# EAGLE schematic quadcopter_tawfic (EAGLE 8.1.1)
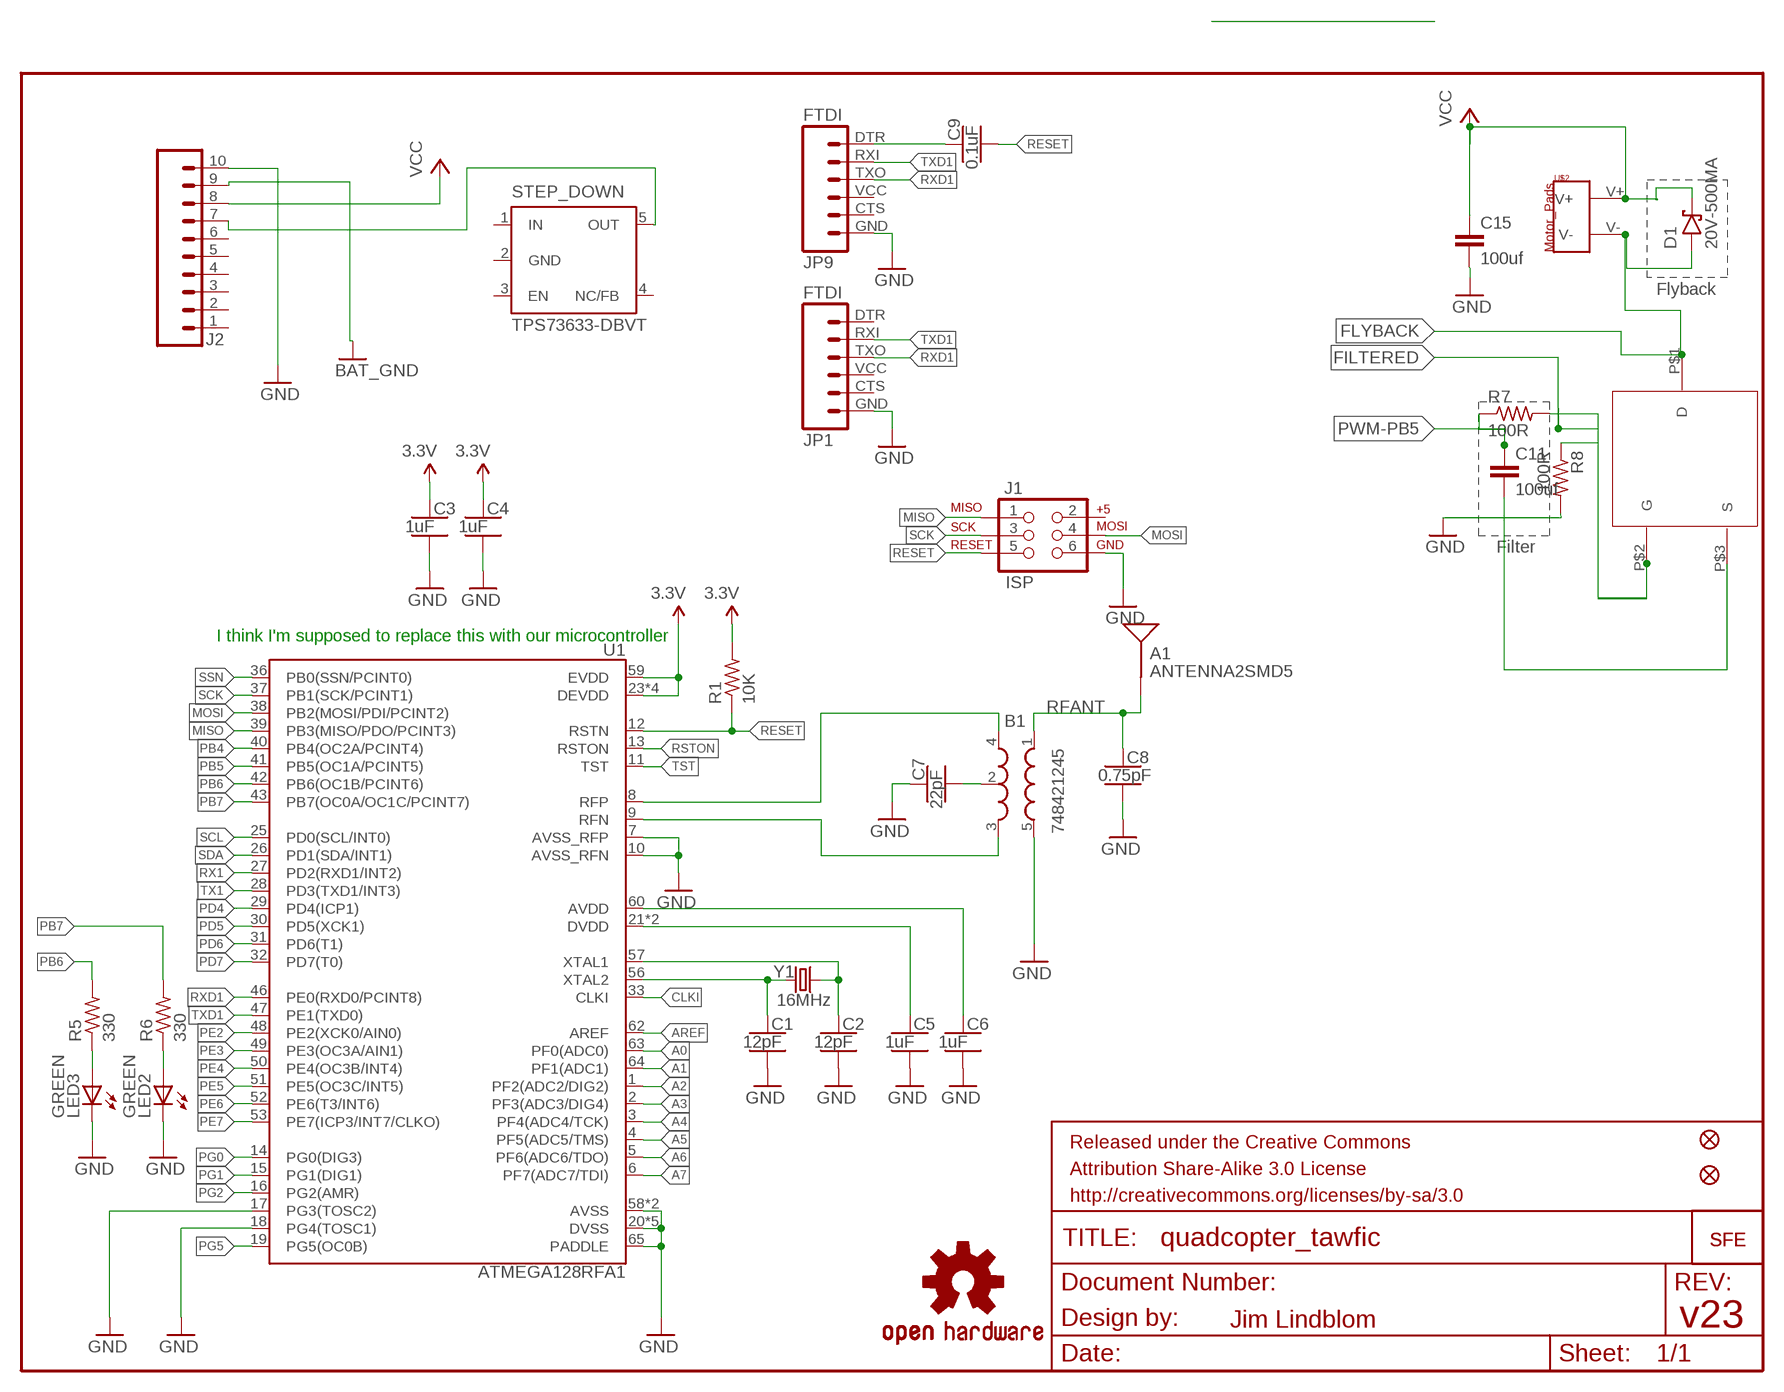
[diagram p0: schematic, sheet 1]

## Parts
A1  ANTENNA2SMD5  [ANTENNA-CHIP5]
B1  748421245  BALUN0805  [BALUN]
C1  12pF  CAPACITOR-NP_SMD-2012-0805_CERAMIC-12PF  [CAPC2012X140_HS]
C2  12pF  CAPACITOR-NP_SMD-2012-0805_CERAMIC-12PF  [CAPC2012X140_HS]
C3  1uF  CAPACITOR-NP_SMD-2012-0805_CERAMIC-1UF  [CAPC2012X140_HS]
C4  1uF  CAPACITOR-NP_SMD-2012-0805_CERAMIC-1UF  [CAPC2012X140_HS]
C5  1uF  CAPACITOR-NP_SMD-2012-0805_CERAMIC-1UF  [CAPC2012X140_HS]
C6  1uF  CAPACITOR-NP_SMD-2012-0805_CERAMIC-1UF  [CAPC2012X140_HS]
C7  22pF  CAPACITOR-NP_SMD-2012-0805_CERAMIC-22PF  [CAPC2012X140_HS]
C8  0.75pF  CAPACITOR-NP_SMD-2012-0805_CERAMIC-0.75PF  [CAPC2012X140_HS]
C9  0.1uF  CAPACITOR-NP_SMD-2012-0805_CERAMIC-0.1UF  [CAPC2012X140_HS]
C11  100uf  C10/4  [C10B4]
C15  100uf  C10/4  [C10B4]
D1  20V-500MA  DIODE-SCHOTTKY_SMD-SOD123-360MV  [SOD3716X135_HS]
FID1  FIDUCIALUFIDUCIAL  [MICRO-FIDUCIAL]
FID2  FIDUCIALUFIDUCIAL  [MICRO-FIDUCIAL]
J1  ISP  AVR_SPI_PRG_6NS  [2X3-NS]
J2  SIP-10_TH-254X10-1  [HDRV10W63P254_10X1_2540X254H838_HS]
JP1  FTDI  FTDI_BASICPTH  [FTDI_BASIC]
JP4  LOGO-SFENEW  [SFE-NEW-WEBLOGO]
JP9  FTDI  FTDI_BASICPTH  [FTDI_BASIC]
JP10  LOGO-SFENEW  [SFE-NEW-WEBLOGO]
LED2  GREEN  LED0603  [LED-0603]
LED3  GREEN  LED0603  [LED-0603]
Q2  MOSFET-SI2302CDS-T1-E3  [MOSFET]
R1  10K  RESISTOR_SMD-2012-0805-10K  [RESC2012X60_HS]
R5  330  RESISTOR_SMD-2012-0805-330  [RESC2012X60_HS]
R6  330  RESISTOR_SMD-2012-0805-330  [RESC2012X60_HS]
R7  100R  R-US_R0805  [R0805]
R8  100R  R-US_R0805  [R0805]
STEP_DOWN  TPS73633-DBVT  [SOT23-DBV]
U1  ATMEGA128RFA1  [QFN-64]
U$1  OSHW-LOGOS  [OSHW-LOGO-S]
U$2  MOTOR_PADS  [MOTOR_PADS]
Y1  16MHz  CRYSTAL5X3  [CRYSTAL-SMD-5X3]

## Nets
3.3V: C3.1 C4.1 R1.2 U1.23(DEVDD) U1.34(DEVDD) U1.44(DEVDD) U1.54(DEVDD) U1.59(EVDD)
A0: U1.63(PF0(ADC0))
A1: U1.64(PF1(ADC1))
A2: U1.1(PF2(ADC2/DIG2))
A3: U1.2(PF3(ADC3/DIG4))
A4: U1.3(PF4(ADC4/TCK))
A5: U1.4(PF5(ADC5/TMS))
A6: U1.5(PF6(ADC6/TDO))
A7: U1.6(PF7(ADC7/TDI))
AREF: U1.62(AREF)
AVDD: C6.1 U1.60(AVDD)
BAT_GND: J2.9
CLKI: U1.33(CLKI)
DTR: C9.1 JP9.DTR
DVDD: C5.1 U1.21(DVDD) U1.22(DVDD)
FILTERED: Q2.P$2(G) R7.2 R8.1
FLYBACK [HighAmps]: D1.A Q2.P$1(D) U$2.V-
GND: B1.5(GND) C1.2 C2.2 C3.2 C4.2 C5.2 C6.2 C7.1 C8.2 C15.2 J1.6 J2.10 JP1.GND JP9.GND LED2.C LED3.C R8.2 U1.7(AVSS_RFP) U1.10(AVSS_RFN) U1.17(PG3(TOSC2)) U1.18(PG4(TOSC1)) U1.20(DVSS) U1.24(DVSS) U1.35(DVSS) U1.45(DVSS) U1.55(DVSS) U1.58(AVSS) U1.61(AVSS) U1.65(PADDLE)
MISO: J1.1 U1.39(PB3(MISO/PDO/PCINT3))
MOSI: J1.4 U1.38(PB2(MOSI/PDI/PCINT2))
N$1: C11.2 Q2.P$3(S)
N$2: J2.7 STEP_DOWN.5(OUT)
N$3: C2.1 U1.57(XTAL1) Y1.3
N$4: C1.1 U1.56(XTAL2) Y1.1
N$7: B1.2(GND) C7.2
N$8: LED3.A R5.1
N$13: LED2.A R6.1
PB4: U1.40(PB4(OC2A/PCINT4))
PB5: U1.41(PB5(OC1A/PCINT5))
PB6: R5.2 U1.42(PB6(OC1B/PCINT6))
PB7: R6.2 U1.43(PB7(OC0A/OC1C/PCINT7))
PD4: U1.29(PD4(ICP1))
PD5: U1.30(PD5(XCK1))
PD6: U1.31(PD6(T1))
PD7: U1.32(PD7(T0))
PE2: U1.48(PE2(XCK0/AIN0))
PE3: U1.49(PE3(OC3A/AIN1))
PE4: U1.50(PE4(OC3B/INT4))
PE5: U1.51(PE5(OC3C/INT5))
PE6: U1.52(PE6(T3/INT6))
PE7: U1.53(PE7(ICP3/INT7/CLKO))
PG0: U1.14(PG0(DIG3))
PG1: U1.15(PG1(DIG1))
PG2: U1.16(PG2(AMR))
PG5: U1.19(PG5(OC0B))
PWM-PB5: C11.1 R7.1
RESET: C9.2 J1.5 R1.1 U1.12(RSTN)
RFANT: A1.FEED(SIGNAL) B1.1(IN) C8.1
RFN: B1.3(OUT2) U1.9(RFN)
RFP: B1.4(OUT1) U1.8(RFP)
RSTON: U1.13(RSTON)
RX1: U1.27(PD2(RXD1/INT2))
RXD1: JP1.TXO JP9.TXO U1.46(PE0(RXD0/PCINT8))
SCK: J1.3 U1.37(PB1(SCK/PCINT1))
SCL: U1.25(PD0(SCL/INT0))
SDA: U1.26(PD1(SDA/INT1))
SSN: U1.36(PB0(SSN/PCINT0))
TST: U1.11(TST)
TX1: U1.28(PD3(TXD1/INT3))
TXD1: JP1.RXI JP9.RXI U1.47(PE1(TXD0))
VCC: C15.1 D1.C J2.8 U$2.V+
Unconnected: J1.2 J2.1 J2.2 J2.3 J2.4 J2.5 J2.6 JP1.CTS JP1.DTR JP1.VCC JP9.CTS JP9.VCC STEP_DOWN.1(IN) STEP_DOWN.2(GND) STEP_DOWN.3(EN) STEP_DOWN.4(NC/FB)

## Notes on the sheet
- Flyback
- Filter
- I think I'm supposed to replace this with our microcontroller
- Jim Lindblom | v23

## Library data of the parts
A1 = SparkFun-RF:ANTENNA2: Chip antenna Single endded antenna. Common with smaller chip antennas. CHIP4 package is the GPS Chip Antenna SKU: GPS-08418. CHIP5 package is 2.4GHz chip antenna SKU: WRL-00144.
B1 = SparkFun-RF:BALUN: 0805 footprint balun- Ember 351/357
C1 C2 = quadparts_prebuilt:CAPACITOR-NP_: Nonpolarized capacitor; DIST: Digikey; DISTPN: 490-5531-1-ND; MFR: Murata Electronics North America; MPN: GRM21A5C2E120JW01D
C3-C6 = quadparts_prebuilt:CAPACITOR-NP_: Nonpolarized capacitor; DIST: Digikey; DISTPN: 490-4736-1-ND; MFR: Murata Electronics North America; MPN: GRM21BR71H105KA12L
C7 = quadparts_prebuilt:CAPACITOR-NP_: Nonpolarized capacitor; DIST: Digikey; DISTPN: 490-5534-1-ND; MFR: Murata Electronics North America; MPN: GRM21A5C2E220JW01D
C8 = quadparts_prebuilt:CAPACITOR-NP_: Nonpolarized capacitor; DIST: Digikey; DISTPN: 490-3585-1-ND; MFR: Murata Electronics North America; MPN: GQM2195C2AR75CB01D
C9 = quadparts_prebuilt:CAPACITOR-NP_: Nonpolarized capacitor; DIST: Digikey; DISTPN: 490-1666-1-ND; MFR: Murata Electronics North America; MPN: GRM21BR71H104KA01L
C11 C15 = capacitor-wima:C: CAPACITOR naming: grid - package width
D1 = quadparts_prebuilt:DIODE-SCHOTTKY_: Schottky diode; DIST: Digikey; DISTPN: CRS08QMCT-ND; MFR: Toshiba Semiconductor and Storage; MPN: CRS08(TE85L,Q,M); VALUE: 360mV
FID1 FID2 = SparkFun-Aesthetics:FIDUCIAL: Fiducial Alignment Points Various fiducial points for machine vision alignment.
J1 = SparkFun-Connectors:AVR_SPI_PRG_6: AVR ISP 6 Pin This is the reduced ISP connector for AVR programming. Common on Arduino. This footprint will take up less PCB space and can be used with a 10-pin to 6-pin adapter such as SKU: BOB-08508
J2 = quadparts_prebuilt:SIP-10_: 10 pin single inline pin header, socket, or connector; DIST: Digikey; DISTPN: 609-3250-ND; MFR: Amphenol FCI; MPN: 68000-110HLF
JP1 JP9 = SparkFun-Connectors:FTDI_BASIC: FTDI Basic header with labels
JP4 JP10 = SparkFun-Aesthetics:LOGO-SFE: Spark Fun Electronics PCB Logo This is the standard Spark Fun Electronics PCB logo.
LED2 LED3 = SparkFun-LED:LED: LEDs Standard schematic elements and footprints for 5mm, 3mm, 1206, and 0603 sized LEDs. 5mm - Spark Fun Electronics SKU : COM-00529 (and others)
Q2 = Lab2:MOSFET-SI2302CDS-T1-E3: DIST – Digikey DISTPN – SI2302CDS-T1-E3CT-ND MFR - Vishay Siliconix MPN - SI2302CDS-T1-E3 CREATOR – Tawfic Rabbani REVIEWER - empty. This will eventually hold the name of a person that reviewed the device.
R1 = quadparts_prebuilt:RESISTOR_: Resistor; DIST: Digikey; DISTPN: 311-10KARCT-ND; MFR: Yageo; MPN: RC0805JR-0710KL
R5 R6 = quadparts_prebuilt:RESISTOR_: Resistor; DIST: Digikey; DISTPN: 311-330ARCT-ND; MFR: Yageo; MPN: RC0805JR-07330RL
R7 R8 = Lab5:R-US_: RESISTOR, American symbol
STEP_DOWN = quadparts_prebuilt:TPS73633-DBVT; DATASHEET: http://www.ti.com/lit/ds/symlink/lp3985.pdf; DIST: Digikey; DISTPN: LP3985IM5X-3.0/NOPBCT-ND; MFR: Texas Instruments; MPN: LP3985IM5X-3.0/NOPB; PRICE: 0.59
U1 = SparkFun-DigitalIC:ATMEGA128RFA1: ATmega128RFA1 8-bit AVR Microcontroller with Low Power 2.4GHz Transceiver for ZigBee and IEEE 802.15.4
U$1 = SparkFun-Aesthetics:OSHW-LOGO: Open Source Hardware Logo This logo indicates the piece of hardware it is found on incorporates a OSHW license and/or adheres to the definition of open source hardware found here: http://freedomdefined.org/OSHW
U$2 = quadparts_prebuilt:MOTOR_PADS; DIST: NA; DISTPN: NA; MFR: NA; MPN: NA
Y1 = SparkFun-FreqCtrl:CRYSTAL: Various standard crystals. Proven footprints. Spark Fun Electronics SKU : COM-00534

## Net classes
1 HighAmps: width 0.762 mm